# Altium schematic sheet Splitter.SchDoc: LiveDesign Evaluation - Stop Watch
size A; DocumentNumber: 2; SheetNumber: 2; SheetTotal: 3; Address1: L3, 12a Rodborough Rd; Address2: Frenchs Forest; Address3: NSW; Address4: Australia 2086; Organization: Altium Limited
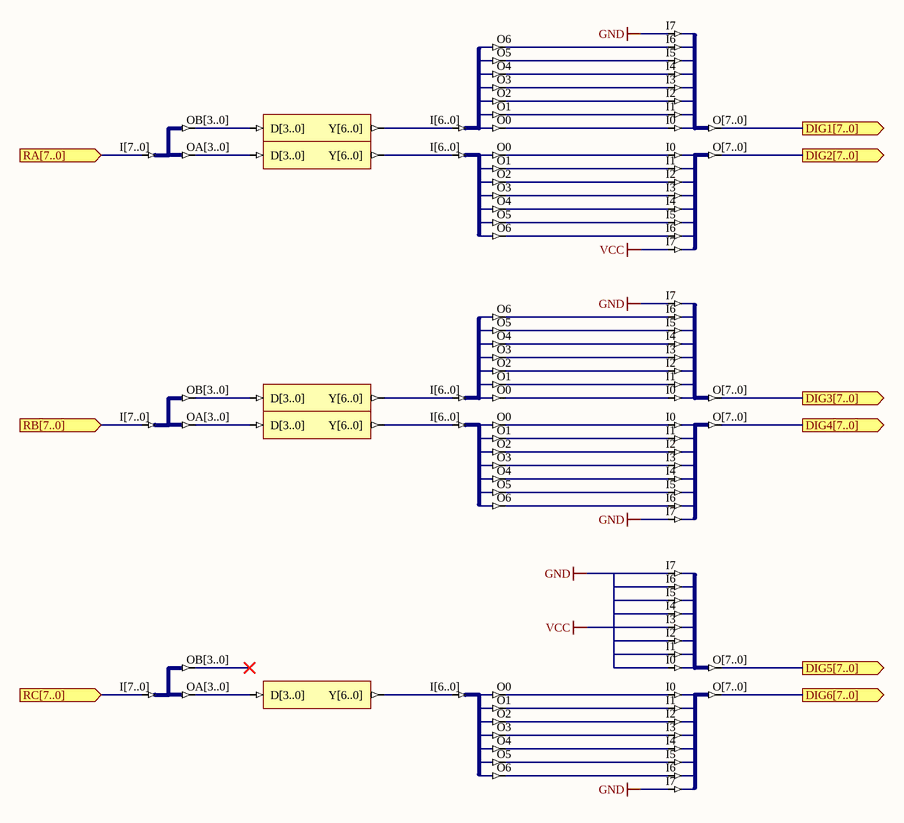
[diagram p0: Splitter.SchDoc]

## Parts
U15  J8S_8B  (value not drawn)
U16  J8S_8B  (value not drawn)
U17  J8S_8B  (value not drawn)
U18  J8S_8B  (value not drawn)
U19  J8S_8B  (value not drawn)
U20  J8S_8B  (value not drawn)
U21  J7B_7S  (value not drawn)
U22  J7B_7S  (value not drawn)
U23  J7B_7S  (value not drawn)
U24  J7B_7S  (value not drawn)
U25  J7B_7S  (value not drawn)
U26  D7SEGB  (value not drawn)
U27  D7SEGB  (value not drawn)
U28  D7SEGB  (value not drawn)
U29  D7SEGB  (value not drawn)
U30  D7SEGB  (value not drawn)
U31  J8B_4B2  (value not drawn)
U32  J8B_4B2  (value not drawn)
U33  J8B_4B2  (value not drawn)

## Ports
DIG1[7..0] (out), DIG2[7..0] (out), DIG3[7..0] (out), DIG4[7..0] (out), DIG5[7..0] (out), DIG6[7..0] (out), RA[7..0] (in), RB[7..0] (in), RC[7..0] (in)

## Nets
GND: U15.I7 U17.I7 U18.I7 U19.I0 U19.I1 U19.I2 U19.I4 U19.I5 U19.I6 U19.I7 U20.I7
VCC: U16.I7 U19.I3
DIG1[7..0]: U15.O[7..0] ; port DIG1[7..0]
DIG2[7..0]: U16.O[7..0] ; port DIG2[7..0]
DIG3[7..0]: U17.O[7..0] ; port DIG3[7..0]
DIG4[7..0]: U18.O[7..0] ; port DIG4[7..0]
DIG5[7..0]: U19.O[7..0] ; port DIG5[7..0]
DIG6[7..0]: U20.O[7..0] ; port DIG6[7..0]
RA[7..0]: U31.I[7..0] ; port RA[7..0]
RB[7..0]: U32.I[7..0] ; port RB[7..0]
RC[7..0]: U33.I[7..0] ; port RC[7..0]
NetU15_I0: U15.I0 U21.O0
NetU15_I1: U15.I1 U21.O1
NetU15_I2: U15.I2 U21.O2
NetU15_I3: U15.I3 U21.O3
NetU15_I4: U15.I4 U21.O4
NetU15_I5: U15.I5 U21.O5
NetU15_I6: U15.I6 U21.O6
NetU16_I0: U16.I0 U22.O0
NetU16_I1: U16.I1 U22.O1
NetU16_I2: U16.I2 U22.O2
NetU16_I3: U16.I3 U22.O3
NetU16_I4: U16.I4 U22.O4
NetU16_I5: U16.I5 U22.O5
NetU16_I6: U16.I6 U22.O6
NetU17_I0: U17.I0 U23.O0
NetU17_I1: U17.I1 U23.O1
NetU17_I2: U17.I2 U23.O2
NetU17_I3: U17.I3 U23.O3
NetU17_I4: U17.I4 U23.O4
NetU17_I5: U17.I5 U23.O5
NetU17_I6: U17.I6 U23.O6
NetU18_I0: U18.I0 U24.O0
NetU18_I1: U18.I1 U24.O1
NetU18_I2: U18.I2 U24.O2
NetU18_I3: U18.I3 U24.O3
NetU18_I4: U18.I4 U24.O4
NetU18_I5: U18.I5 U24.O5
NetU18_I6: U18.I6 U24.O6
NetU20_I0: U20.I0 U25.O0
NetU20_I1: U20.I1 U25.O1
NetU20_I2: U20.I2 U25.O2
NetU20_I3: U20.I3 U25.O3
NetU20_I4: U20.I4 U25.O4
NetU20_I5: U20.I5 U25.O5
NetU20_I6: U20.I6 U25.O6
NetU21_I[6..0]: U21.I[6..0] U26.Y[6..0]
NetU22_I[6..0]: U22.I[6..0] U27.Y[6..0]
NetU23_I[6..0]: U23.I[6..0] U28.Y[6..0]
NetU24_I[6..0]: U24.I[6..0] U29.Y[6..0]
NetU25_I[6..0]: U25.I[6..0] U30.Y[6..0]
NetU26_D[3..0]: U26.D[3..0] U31.OB[3..0]
NetU27_D[3..0]: U27.D[3..0] U31.OA[3..0]
NetU28_D[3..0]: U28.D[3..0] U32.OB[3..0]
NetU29_D[3..0]: U29.D[3..0] U32.OA[3..0]
NetU30_D[3..0]: U30.D[3..0] U33.OA[3..0]

Not connected (* = marked no-connect by the designer): U33 OB[3..0]*

## Notes on the sheet
- Title
- Size:
- Date:
- A
- Number:
- Time:
- Revision:
- Sheet
- of
- File:

## Library data of the parts
U15-U20 = J8S_8B: 8 Single pin inputs to single 8-Bit output bus; FunctionalClass: Bus Joiner; PortSize: 8; ArchiveName: GENERIC; VHDLIB_SIM: GENERIC_LIB; Published: 29-Jan-2004; Publisher: Altium Limited; LastRevisionNo: 1.00.00; HelpURL: CR0118 FPGA Generic Library Guide.pdf#page=305
U21-U25 = J7B_7S: 7-Bit input bus to 7 Single pin outputs; FunctionalClass: Bus Joiner; PortSize: 7; ArchiveName: GENERIC; VHDLIB_SIM: GENERIC_LIB; Published: 29-Jan-2004; Publisher: Altium Limited; LastRevisionNo: 1.00.00; HelpURL: CR0118 FPGA Generic Library Guide.pdf#page=303
U26-U30 = D7SEGB: 7-Segment-Display Decoder for Common-Cathode LED (Active High Output), Bus Version; ArchiveName: GENERIC; VHDLIB_SIM: GENERIC_LIB; Published: 29-Jan-2004; Publisher: Altium Limited; Core Revision: 1.00.00
U31-U33 = J8B_4B2: 1 x 8-bit input bus to 2 x 4-Bit output bus; FunctionalClass: Bus Joiner; PortSize: 8; ArchiveName: GENERIC; VHDLIB_SIM: GENERIC_LIB; Published: 29-Jan-2004; Publisher: Altium Limited; LastRevisionNo: 1.00.00; HelpURL: CR0118 FPGA Generic Library Guide.pdf#page=297